# EAGLE design MicroMod-Artemis-ProcessorBoard (EAGLE 9.6.2)
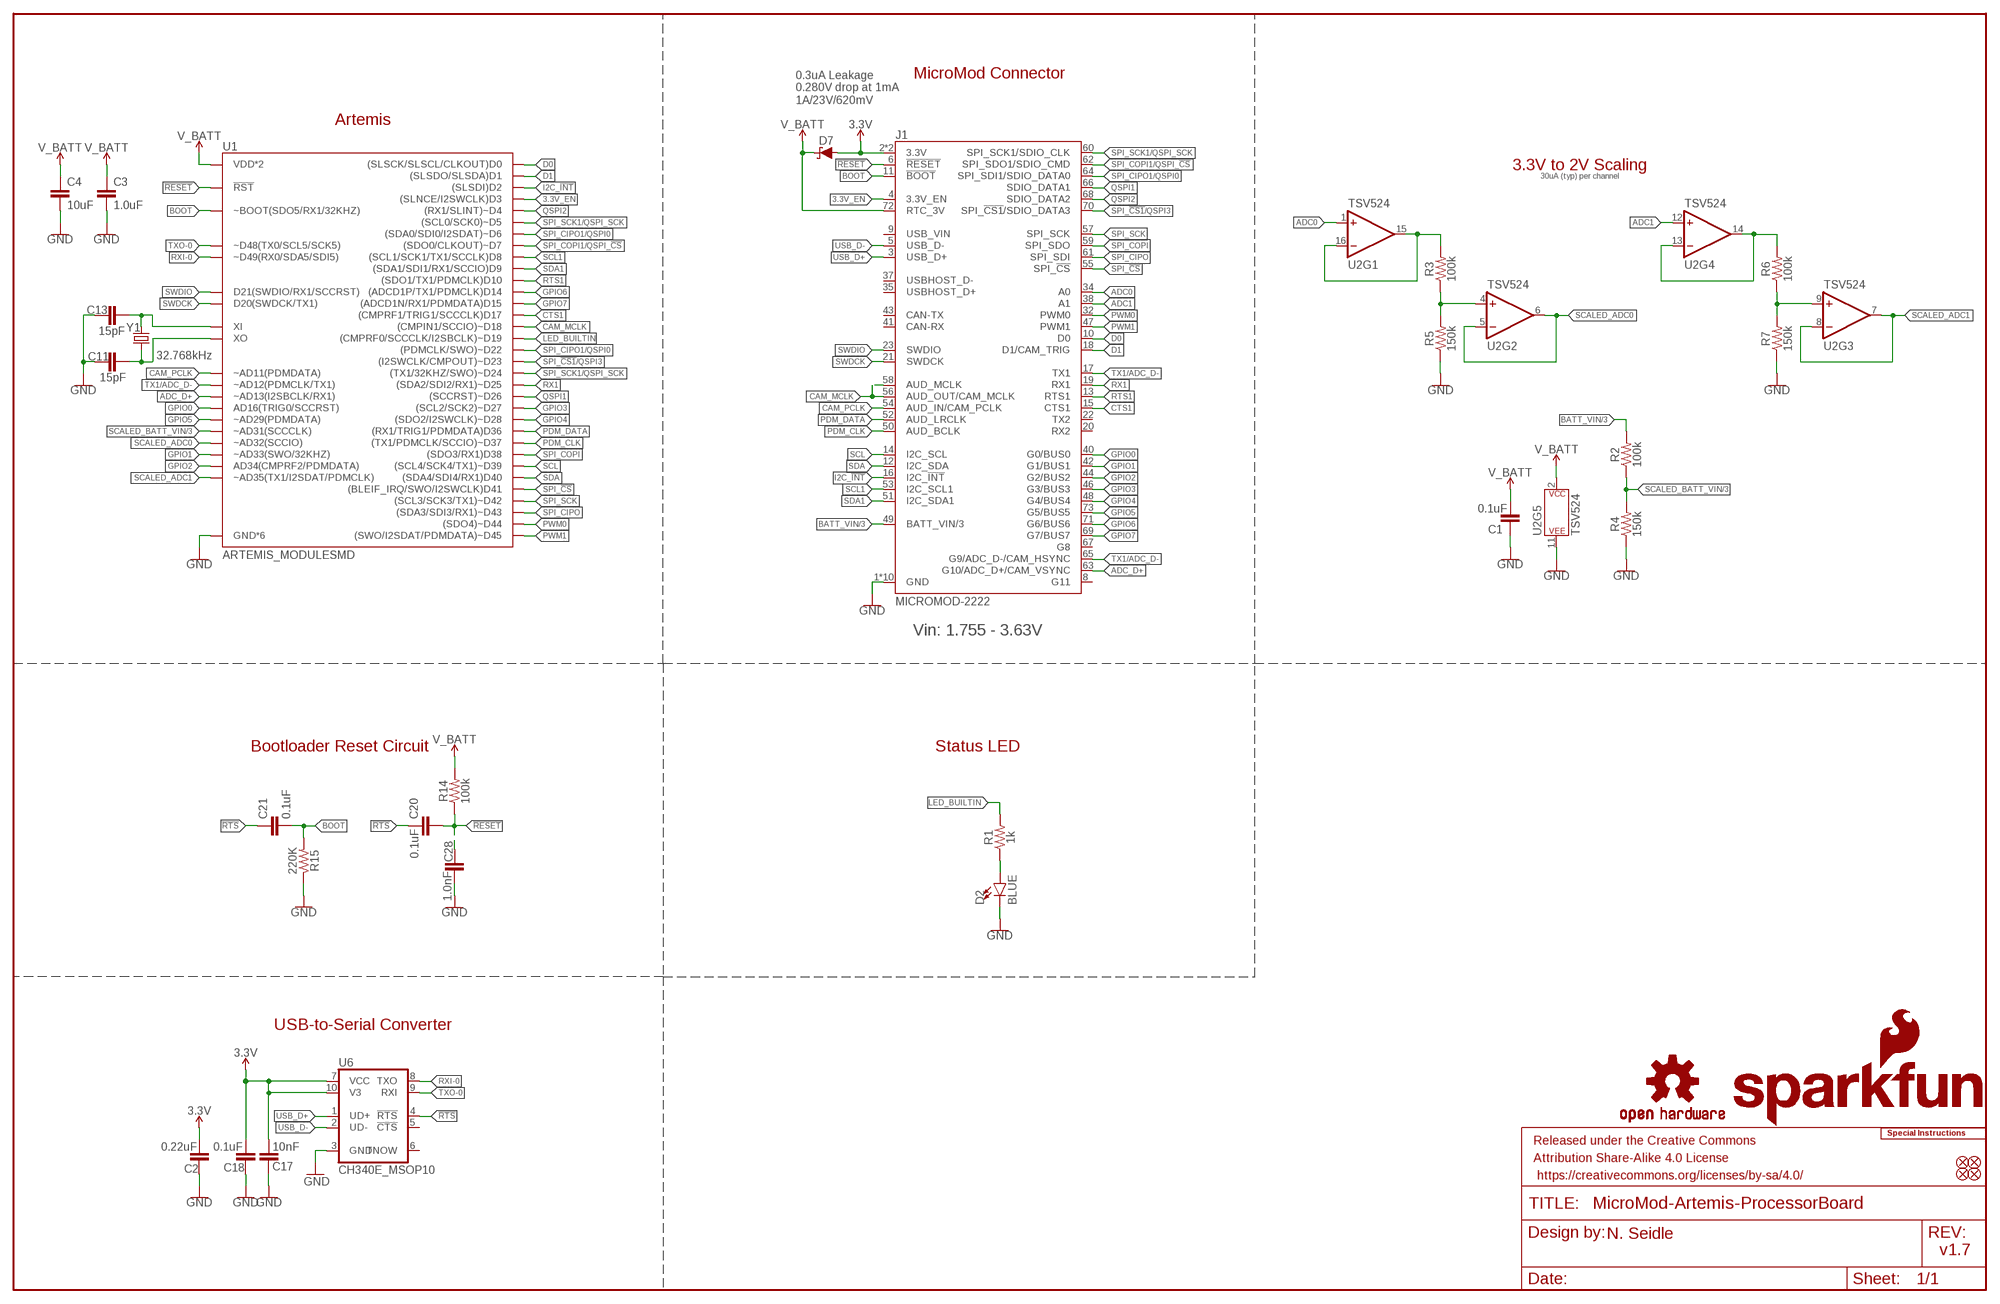
[diagram p0: schematic, sheet 1]

## Parts
C1  0.1uF  0.1UF-0402T-16V-10%  [0402-TIGHT]
C2  0.22uF  0.22UF-0402T-10V-10%  [0402-TIGHT]
C3  1.0uF  1.0UF-0402T-16V-10%  [0402-TIGHT]
C4  10uF  10UF-0603-6.3V-20%  [0603]
C11  15pF  15PF-0402T-50V-5%  [0402-TIGHT]
C13  15pF  15PF-0402T-50V-5%  [0402-TIGHT]
C17  10nF  10NF-0402T-25V-10%  [0402-TIGHT]
C18  0.1uF  0.1UF-0402T-16V-10%  [0402-TIGHT]
C20  0.1uF  0.1UF-0402T-16V-10%  [0402-TIGHT]
C21  0.1uF  0.1UF-0402T-16V-10%  [0402-TIGHT]
C28  1.0nF  1.0NF/1000PF-0402_TIGHT-50V-10%  [0402-TIGHT]
D2  BLUE  LED-BLUE0603  [LED-0603]
D7  1A/23V/620mV  DIODE-SCHOTTKY-BAT20J  [SOD-323]
FD1  FIDUCIALUFIDUCIAL  [FIDUCIAL-MICRO]
FD2  FIDUCIALUFIDUCIAL  [FIDUCIAL-MICRO]
FD3  FIDUCIALUFIDUCIAL  [FIDUCIAL-MICRO]
FD4  FIDUCIALUFIDUCIAL  [FIDUCIAL-MICRO]
FRAME1  FRAME-LEDGER  [CREATIVE_COMMONS]
J1  MICROMOD-2222  [M.2-CARD-E-22]
LOGO1  SFE_LOGO_NAME_FLAME.1_INCH  [SFE_LOGO_NAME_FLAME_.1]
LOGO2  SFE_LOGO_FLAME.1_INCH  [SFE_LOGO_FLAME_.1]
LOGO3  OSHW-LOGOMINI  [OSHW-LOGO-MINI]
LOGO4  SPECIAL_INSTRUCTIONS-ORDERING  [ORDERING_INSTRUCTIONS]
R1  1k  1KOHM-0402T-1/16W-1%  [0402-TIGHT]
R2  100k  100KOHM-0402T-1/16W-1%  [0402-TIGHT]
R3  100k  100KOHM-0402T-1/16W-1%  [0402-TIGHT]
R4  150k  150KOHM-0402T-1/16W-1%  [0402-TIGHT]
R5  150k  150KOHM-0402T-1/16W-1%  [0402-TIGHT]
R6  100k  100KOHM-0402T-1/16W-1%  [0402-TIGHT]
R7  150k  150KOHM-0402T-1/16W-1%  [0402-TIGHT]
R14  100k  100KOHM-0402T-1/16W-1%  [0402-TIGHT]
R15  220K  220KOHM-0402T-1/16W-1%  [0402-TIGHT]
U1  ARTEMIS_MODULESMD  [ARTEMIS_FP]
U2  TSV524  [QFN-16]
U6  CH340E_MSOP10  [MSOP10]
Y1  32.768kHz  CRYSTAL-32.768KHZSMD-3.2X1.5  [CRYSTAL-SMD-3.2X1.5MM]

## Nets
3.3V: C2.1 C17.1 C18.1 D7.A J1.2(3.3V) J1.74(3.3V) U6.7(VCC) U6.10(V3)
3.3V_EN: J1.4(3.3V_EN) U1.D3((SLNCE/I2SWCLK)D3)
!RESET!: C20.2 C28.1 J1.6(!RESET!) R14.1 U1.~RST(!RST)
!RTS: C20.1 C21.1 U6.4(!RTS)
ADC0: J1.34(A0) U2.1(+IN)
ADC0_BUFF1: R3.2 U2.15(OUT) U2.16(-IN)
ADC0_BUFF2: R3.1 R5.2 U2.4(+IN)
ADC1: J1.38(A1) U2.12(+IN)
ADC1_BUFF2: R6.1 R7.2 U2.9(+IN)
ADC_BUFF1: R6.2 U2.13(-IN) U2.14(OUT)
ADC_D+: J1.63(G10/ADC_D+/CAM_VSYNC) U1.~AD13(~AD13(I2SBCLK/RX1))
BATT_VIN/3: J1.49(BATT_VIN/3) R2.2
BOOT: C21.2 J1.11(!BOOT!) R15.2 U1.BOOT(~BOOT(SDO5/RX1/32KHZ))
CAM_MCLK: J1.56(AUD_OUT/CAM_MCLK) J1.58(AUD_MCLK) U1.~D18((CMPIN1/SCCIO)~D18)
CAM_PCLK: J1.54(AUD_IN/CAM_PCLK) U1.~AD11(~AD11(PDMDATA))
CTS1: J1.15(CTS1) U1.D17((CMPRF1/TRIG1/SCCCLK)D17)
D0: J1.10(D0) U1.D0((SLSCK/SLSCL/CLKOUT)D0)
D1: J1.18(D1/CAM_TRIG) U1.D1((SLSDO/SLSDA)D1)
GND: C1.2 C2.2 C3.2 C4.2 C11.1 C13.1 C17.2 C18.2 C28.2 D2.C J1.1(GND) J1.7(GND) J1.33(GND) J1.36(GND) J1.39(GND) J1.45(GND) J1.75(GND) J1.GND1(GND) J1.GND2(GND) J1.GND3(GND) R4.1 R5.1 R7.1 R15.1 U1.GND@1(GND*6) U1.GND@22(GND*6) U1.GND@38(GND*6) U1.GND@39(GND*6) U1.GND@47(GND*6) U1.GND@59(GND*6) U2.11(V-) U6.3(GND)
GPIO0: J1.40(G0/BUS0) U1.AD16(AD16(TRIG0/SCCRST))
GPIO1: J1.42(G1/BUS1) U1.~AD33/SWO(~AD33(SWO/32KHZ))
GPIO2: J1.44(G2/BUS2) U1.AD34(AD34(CMPRF2/PDMDATA))
GPIO3: J1.46(G3/BUS3) U1.~D27((SCL2/SCK2)~D27)
GPIO4: J1.48(G4/BUS4) U1.~D28((SDO2/I2SWCLK)~D28)
GPIO5: J1.73(G5/BUS5) U1.~AD29(~AD29(PDMDATA))
GPIO6: J1.71(G6/BUS6) U1.D14((ADCD1P/TX1/PDMCLK)D14)
GPIO7: J1.69(G7/BUS7) U1.D15((ADCD1N/RX1/PDMDATA)D15)
I2C_!INT!: J1.16(I2C_!INT!) U1.D2((SLSDI)D2)
LED_BUILTIN: R1.2 U1.~D19((CMPRF0/SCCCLK/I2SBCLK)~D19)
N$2: D2.A R1.1
N$5: C13.2 U1.XI Y1.P$1
N$7: C11.2 U1.XO Y1.P$2
PDM_CLK: J1.50(AUD_BCLK) U1.~D37((TX1/PDMCLK/SCCIO)~D37)
PDM_DATA: J1.52(AUD_LRCLK) U1.D36((RX1/TRIG1/PDMDATA)D36)
PWM0: J1.32(PWM0) U1.~D44((SDO4)~D44)
PWM1: J1.47(PWM1) U1.~D45((SWO/I2SDAT/PDMDATA)~D45)
QSPI1: J1.66(SDIO_DATA1) U1.~D26((SCCRST)~D26)
QSPI2: J1.68(SDIO_DATA2) U1.~D4((RX1/SLINT)~D4)
RTS1: J1.13(RTS1) U1.D10((SDO1/TX1/PDMCLK)D10)
RX1: J1.19(RX1) U1.~D25((SDA2/SDI2/RX1)~D25)
RXI-0: U1.RXI-0(~D49(RX0/SDA5/SDI5)) U6.8(TXO)
SCALED_ADC0: U1.~AD32(~AD32(SCCIO)) U2.5(-IN) U2.6(OUT)
SCALED_ADC1: U1.~AD35(~AD35(TX1/I2SDAT/PDMCLK)) U2.7(OUT) U2.8(-IN)
SCALED_BATT_VIN/3: R2.1 R4.2 U1.~AD31(~AD31(SCCCLK))
SCL: J1.14(I2C_SCL) U1.~D39((SCL4/SCK4/TX1)~D39)
SCL1: J1.53(I2C_SCL1) U1.D8((SCL1/SCK1/TX1/SCCLK)D8)
SDA: J1.12(I2C_SDA) U1.D40((SDA4/SDI4/RX1)D40)
SDA1: J1.51(I2C_SDA1) U1.D9((SDA1/SDI1/RX1/SCCIO)D9)
SPI_!CS1!/QSPI3: J1.70(SPI_!CS1!/SDIO_DATA3) U1.~D23((I2SWCLK/CMPOUT)~D23)
SPI_!CS!: J1.55(SPI_!CS!) U1.D41((BLEIF_IRQ/SWO/I2SWCLK)D41)
SPI_CIPO: J1.61(SPI_SDI) U1.~D43((SDA3/SDI3/RX1)~D43)
SPI_CIPO1/QSPI0: J1.64(SPI_SDI1/SDIO_DATA0) U1.~D6((SDA0/SDI0/I2SDAT)~D6) U1.~D22((PDMCLK/SWO)~D22)
SPI_COPI: J1.59(SPI_SDO) U1.D38((SDO3/RX1)D38)
SPI_COPI1/QSPI_!CS!: J1.62(SPI_SDO1/SDIO_CMD) U1.D7((SDO0/CLKOUT)~D7)
SPI_SCK: J1.57(SPI_SCK) U1.~D42((SCL3/SCK3/TX1)~D42)
SPI_SCK1/QSPI_SCK: J1.60(SPI_SCK1/SDIO_CLK) U1.~D5((SCL0/SCK0)~D5) U1.~D24((TX1/32KHZ/SWO)~D24)
SWDCK: J1.21(SWDCK) U1.SWDCK(D20(SWDCK/TX1))
SWDIO: J1.23(SWDIO) U1.SWDIO(D21(SWDIO/RX1/SCCRST))
TX1/ADC_D-: J1.17(TX1) J1.65(G9/ADC_D-/CAM_HSYNC) U1.~AD12(~AD12(PDMCLK/TX1))
TXO-0: U1.TXO-0(~D48(TX0/SCL5/SCK5)) U6.9(RXI)
USB_D+: J1.3(USB_D+) U6.1(UD+)
USB_D-: J1.5(USB_D-) U6.2(UD-)
V_BATT: C1.1 C3.1 C4.1 D7.C J1.72(RTC_3V) R14.2 U1.VDD@36(VDD*2) U1.VDD@37(VDD*2) U2.2(V+)
Unconnected: J1.8(G11) J1.9(USB_VIN) J1.20(RX2) J1.22(TX2) J1.35(USBHOST_D+) J1.37(USBHOST_D-) J1.41(CAN-RX) J1.43(CAN-TX) J1.67(G8) U6.5(!CTS) U6.6(TNOW)

## Notes on the sheet
- MicroMod Connector
- 0.3uA Leakage
  0.280V drop at 1mA
- Artemis
- 3.3V to 2V Scaling
- 30uA (typ) per channel
- Vin: 1.755 - 3.63V
- Bootloader Reset Circuit | Status LED
- USB-to-Serial Converter
- N. Seidle
- v1.7

## Library data of the parts
C1 C18 C20 C21 = SparkFun-Capacitors:0.1UF: 0.1µF ceramic capacitors A capacitor is a passive two-terminal electrical component used to store electrical energy temporarily in an electric field.; PROD_ID: CAP-12416
C2 = SparkFun-Capacitors:0.22UF: 0.22µF ceramic capacitors A capacitor is a passive two-terminal electrical component used to store electrical energy temporarily in an electric field.; PROD_ID: CAP-14846
C3 = SparkFun-Capacitors:1.0UF: 1µF ceramic capacitors A capacitor is a passive two-terminal electrical component used to store electrical energy temporarily in an electric field.; PROD_ID: CAP-12417
C4 = SparkFun-Capacitors:10UF: 10.0µF ceramic capacitors A capacitor is a passive two-terminal electrical component used to store electrical energy temporarily in an electric field.; PROD_ID: CAP-11015
C11 C13 = SparkFun-Capacitors:15PF: 15pF ceramic capacitors A capacitor is a passive two-terminal electrical component used to store electrical energy temporarily in an electric field.; PROD_ID: CAP-13063
C17 = SparkFun-Capacitors:10NF: 0.01uF/10nF/10,000pF ceramic capacitors A capacitor is a passive two-terminal electrical component used to store electrical energy temporarily in an electric field. CAP-09321; PROD_ID: CAP-14847
C28 = SparkFun-Capacitors:1.0NF/1000PF: 1nF/1,000pF ceramic capacitors A capacitor is a passive two-terminal electrical component used to store electrical energy temporarily in an electric field.; PROD_ID: CAP-14280
D2 = SparkFun-LED:LED-BLUE: Blue SMD LED Used in manufacturing of various products at SparkFun Packages: 0603 - SMD 0603 package [Product Link] <http://www.digikey.com/product-detail/en/SMLE12BC7TT86/511-1589-2-ND/1641808> 1206 - SMD1206 package [Product Link] <http://www.digikey.com/product-detail/en/lite-on-inc/LTST-C150TBKT/160-1643-1-ND/573584> SparkFun Products: ESP8266 Thing-Dev Board <https://www.sparkfun.com/products/13711> RedBoard <https://www.sparkfun.com/products/12757>; PROD_ID: DIO-08575
D7 = SparkFun-DiscreteSemi:DIODE-SCHOTTKY: Schottky diode A Schottky diode is a semiconductor diode which has a low forward voltage drop and a very fast switching action.; PROD_ID: DIO-11623
FD1-FD4 = SparkFun-Aesthetics:FIDUCIAL: Fiducial Alignment Points Point-of-reference for pick-and-place machines and other optical instruments.
FRAME1 = SparkFun-Aesthetics:FRAME-LEDGER: Schematic Frame - Ledger Standard 11x14 US Ledger frame
J1 = SparkFun-MicroMod:MICROMOD: MicroMod Connector Description: A card edge connector and mating PCB connector to allow various MicroMod Processor Boards to be coupled with various carrier boards of different capabilities. Based on the M.2 standard.
LOGO1 = SparkFun-Aesthetics:SFE_LOGO_NAME_FLAME: SparkFun Font Logo w/ Flame This is the SparkFun full logo. The logo on the schematic will always be the same size; the package variant is the height of the flame part of the logo. Default layer for the logo on the board is tSilk.
LOGO2 = SparkFun-Aesthetics:SFE_LOGO_FLAME: SparkFun Flame Logo This is the SparkFun flame logo. The logo on the schematic will always be the same size; the package variant is the height of the flame. Default layer for the logo on the board is tSilk.
LOGO3 = SparkFun-Aesthetics:OSHW-LOGO: Open-Source Hardware (OSHW) Logo This logo indicates the piece of hardware it is found on incorporates a OSHW license and/or adheres to the definition of open source hardware found here: http://freedomdefined.org/OSHW
LOGO4 = SparkFun-Aesthetics:SPECIAL_INSTRUCTIONS: Special Ordering/Production Instructions Alert Symbol for special PCB ordering instructions or unique production process warnings. Ordering Instructions Production Instructions Types of information that should be added to box: Copper weight Soldermask color Silk color PCB thickness Number of layers PCB Standard: 1.6mm FR4 1 oz copper immersion silver plating red soldermask white silkscreen Types of information that should be added to box: Special wash requirements Depaneling instructions Humidification Glue curing Default text settings: 0.07 inch 9% ratio 50% line distance
R1 = SparkFun-Resistors:1KOHM: 1kΩ resistor A resistor is a passive two-terminal electrical component that implements electrical resistance as a circuit element. Resistors act to reduce current flow, and, at the same time, act to lower voltage levels within circuits. - Wikipedia; PROD_ID: RES-14342
R2 R3 R6 R14 = SparkFun-Resistors:100KOHM: 100kΩ resistor A resistor is a passive two-terminal electrical component that implements electrical resistance as a circuit element. Resistors act to reduce current flow, and, at the same time, act to lower voltage levels within circuits. - Wikipedia; PROD_ID: RES-13495
R4 R5 R7 = SparkFun-Resistors:150KOHM: 150kΩ resistor A resistor is a passive two-terminal electrical component that implements electrical resistance as a circuit element. Resistors act to reduce current flow, and, at the same time, act to lower voltage levels within circuits. - Wikipedia; PROD_ID: RES-15093
R15 = SparkFun-Resistors:220KOHM: 220kΩ resistor A resistor is a passive two-terminal electrical component that implements electrical resistance as a circuit element. Resistors act to reduce current flow, and, at the same time, act to lower voltage levels within circuits. - Wikipedia; PROD_ID: RES-15094
U1 = SparkFun-IC-Microcontroller:ARTEMIS_MODULE: Description: The Artemis Module from SparkFun is a Cortex-M4F with BLE 5.0 running up to 96MHz and with as low power as 6uA per MHz (less than 5mW). This is the world's first module to bridge the market between hobbyists and consumer products. We've packaged all the power of a modern microcontroller into a module that is both extremely easy to use but is mass-market ready. The flexibility of the Artemis module starts with our [Arduino core](https://github.com/sparkfun/Arduino_Apollo3). You can program and use the Artemis module just like you would an Uno or any other Arduino. Time to first blink is just 5 minutes away! We built the core from the ground up, making it fast and as light weight as possible.; PROD_ID: SUB-14402
U2 = OpAmp:TSV524: IC TSV524 Quad Op Amp; PROD_ID: IC-15092
U6 = SparkFun-IC-Comms:CH340E; PROD_ID: IC-14135
Y1 = SparkFun-Clocks:CRYSTAL-32.768KHZ: 32.768kHz Crystal Frequency: 32.768kHz Frequency Stability: ±20ppm Load Capacitance: 12.5pF (PTH-2X6 & SMD-3.2X1.5), 6pF (SMD-2X6) SparkFun Products: SparkFun BigTime Watch Kit <https://www.sparkfun.com/products/11734> SparkFun nRF52832 Breakout <https://www.sparkfun.com/products/13990> SparkFun Real Time Clock Module <https://www.sparkfun.com/products/12708>; PROD_ID: XTAL-13062

## Net classes
0 default: width 0 mm, drill 0 mm

## Board
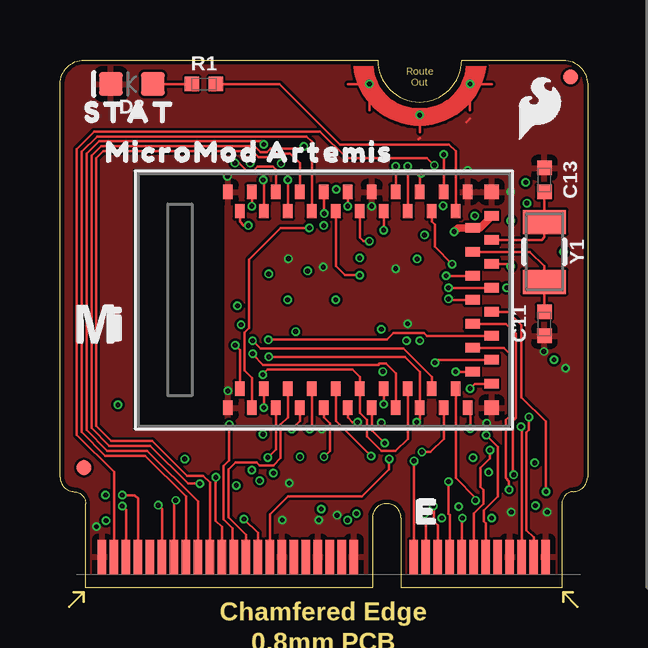
[diagram p1: board, top side]
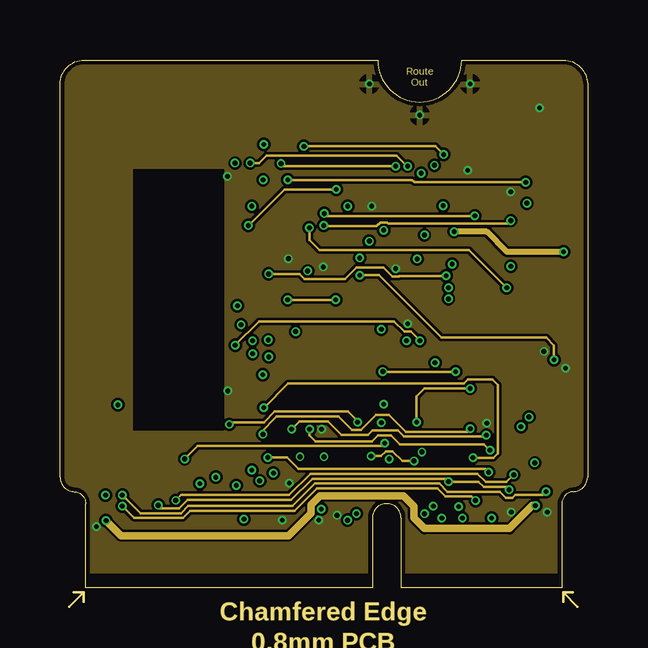
[diagram p2: board, inner layer Horz]
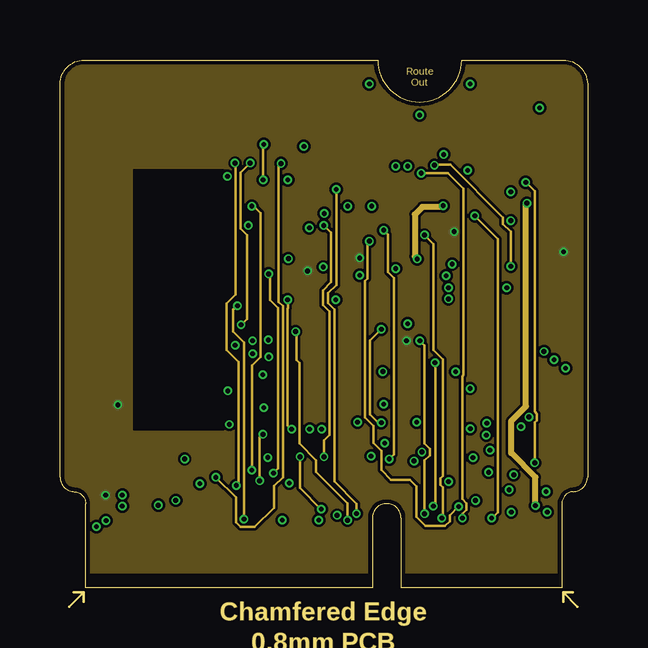
[diagram p3: board, inner layer Vert]
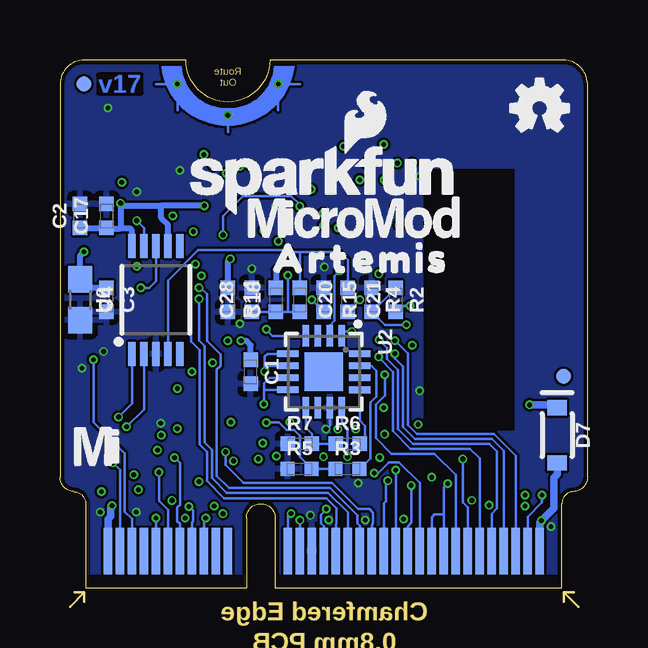
[diagram p4: board, bottom side, seen from below]

Size 22 x 22 mm. Coordinates in mm from the lower left corner, seen from the top.
Outline: 0,4.6 0,21 arc-87 1,22 13.25,22 arc180 16.75,22 21,22 arc-87 22,21 22,4.6
Outline: 0,4.6 arc87 0.6,4
Outline: 21.4,4 arc87 22,4.6
Outline: 21.4,4 arc85 20.93,3.5 20.93,0 14.22,0 14.22,2.9 arc180 13.03,2.9 13.03,0 1.07,0 1.07,3.5 arc84 0.6,4
Outline: 21.4,4 arc87 22,4.6
Outline: 0,4.6 arc87 0.6,4
Copper layers (1+2*15+16): Top 0.035mm / dielectric 1.5mm / Horz 0.035mm / dielectric 0.15mm / Vert 0.035mm / dielectric 0.2mm / Bottom 0.035mm
Design rules "SparkFun-4-layer-MicroMod": minimum track width 4mil, minimum drill 0.2mm, track to track 4mil, track to pad 4mil, pad to pad 4mil, via to via 4mil, smd to smd 4mil, copper to edge 6mil, drill to drill 6mil, minimum pad ring 3mil, minimum via ring 3mil, stop-mask expansion 4mil, vias tented up to drill 25mil, thermal gap 10mil
tKeepout: area 3.1,6.6 to 6.6,17.3

### Footprints (pad centres in the part's own frame; a part is rotated, then mirrored left to right if it is on the bottom)
0402-TIGHT = smd 0.6 x 0.6: 1 -0.5,0; 2 0.5,0
0603 = smd 1.1 x 1: 1 -0.85,0; 2 0.85,0
LED-0603 = smd 1 x 1: A -0.877,0; C 0.877,0
SOD-323 = smd 0.63 x 0.83: A 1.15,0; C -1.15,0
FIDUCIAL-MICRO = smd 0.635 x 0.635: 1 0,0
M.2-CARD-E-22 = smd 0.35 x 1.45: 1 9.25,1.275; 3 8.75,1.275; 5 8.25,1.275; 7 7.75,1.275; 9 7.25,1.275; 11 6.75,1.275; 13 6.25,1.275; 15 5.75,1.275; 17 5.25,1.275; 19 4.75,1.275; 21 4.25,1.275; 23 3.75,1.275; 33 1.25,1.275; 35 0.75,1.275; 37 0.25,1.275; 39 -0.25,1.275; 41 -0.75,1.275; 43 -1.25,1.275; 45 -1.75,1.275; 47 -2.25,1.275; 49 -2.75,1.275; 51 -3.25,1.275; 53 -3.75,1.275; 55 -4.25,1.275; 57 -4.75,1.275; 59 -5.25,1.275; 61 -5.75,1.275; 63 -6.25,1.275; 65 -6.75,1.275; 67 -7.25,1.275; 69 -7.75,1.275; 71 -8.25,1.275; 73 -8.75,1.275; 75 -9.25,1.275 | smd 0.35 x 1.95 bottom: 2 9,1.525; 4 8.5,1.525; 6 8,1.525; 8 7.5,1.525; 10 7,1.525; 12 6.5,1.525; 14 6,1.525; 16 5.5,1.525; 18 5,1.525; 20 4.5,1.525; 22 4,1.525; 32 1.5,1.525; 34 1,1.525; 36 0.5,1.525; 38 0,1.525; 40 -0.5,1.525; 42 -1,1.525; 44 -1.5,1.525; 46 -2,1.525; 48 -2.5,1.525; 50 -3,1.525; 52 -3.5,1.525; 54 -4,1.525; 56 -4.5,1.525; 58 -5,1.525; 60 -5.5,1.525; 62 -6,1.525; 64 -6.5,1.525; 66 -7,1.525; 68 -7.5,1.525; 70 -8,1.525; 72 -8.5,1.525; 74 -9,1.525 | drill 0.2: GND1 1.9,21; GND2 4,19.7; GND3 6.1,21
ARTEMIS_FP = smd 0.4 x 0.6: AD16 -4,-3.7; BOOT 1.5,4.5; D0 0.5,-4.5; D1 -0.5,-4.5; D2 -1,-3.7; D3 2,-3.7; D7 -1.5,4.5; D8 -0.5,4.5; D9 2,3.7; D10 1,3.7; D14 -5,3.7; D17 -3.5,-4.5; D36 2.5,-4.5; D38 3,-3.7; D40 2.5,4.5; D41 -2.5,-4.5; GND@1 4.5,4.5; GND@39 -5.5,-4.5; GND@47 -1.5,-4.5; GND@59 4.5,-4.5; RXI-0 3.5,4.5; SWDCK 4,3.7; SWDIO 0,3.7; TXO-0 0.5,4.5; ~AD31 -3,-3.7; ~AD35 -2,3.7; ~D4 -2.5,4.5; ~D5 -1,3.7; ~D18 -4.5,-4.5; ~D19 -5,-3.7; ~D22 -3.5,4.5; ~D23 -4,3.7; ~D24 -3,3.7; ~D27 -4.5,4.5; ~D28 -5.5,4.5; ~D37 3.5,-4.5; ~D39 3,3.7; ~D42 1.5,-4.5; ~D43 1,-3.7; ~D44 4,-3.7; ~D45 -2,-3.7; ~RST 0,-3.7 | smd 0.6 x 0.4: AD34 -6.5,-0.5; D15 -6.5,0.5; VDD@36 -5.7,-3; VDD@37 -6.5,-3.5; XI -6.5,-2.5; XO -5.7,-2; ~AD11 -5.7,-1; ~AD12 -5.7,2; ~AD13 -5.7,1; ~AD29 -6.5,-1.5; ~AD32 -5.7,3; ~AD33/SWO -5.7,0; ~D6 -6.5,3.5; ~D25 -6.5,2.5; ~D26 -6.5,1.5 | smd 0.6 x 0.6: GND@22 -6.5,4.5; GND@38 -6.5,-4.5
QFN-16 = smd 0.9 x 0.29: 1 -1.5,0.75; 2 -1.5,0.25; 3 -1.5,-0.25; 4 -1.5,-0.75; 9 1.5,-0.75; 10 1.5,-0.25; 11 1.5,0.25; 12 1.5,0.75 | smd 0.29 x 0.9: 5 -0.75,-1.5; 6 -0.25,-1.5; 7 0.25,-1.5; 8 0.75,-1.5; 13 0.765,1.5; 14 0.25,1.5; 15 -0.25,1.5; 16 -0.75,1.5 | smd 1.6 x 1.6: 17 0,0
MSOP10 = smd 1 x 0.3: 1 -2.25,1; 2 -2.25,0.5; 3 -2.25,0; 4 -2.25,-0.5; 5 -2.25,-1; 6 2.25,-1; 7 2.25,-0.5; 8 2.25,0; 9 2.25,0.5; 10 2.25,1
CRYSTAL-SMD-3.2X1.5MM = smd 1 x 1.8: P$1 -1.25,0; P$2 1.25,0

### Placement (x,y rotation side)
C1  14.05,9 270 bottom
C2  21.16,15.5 90 bottom
C3  20.06,12 270 bottom
C4  21.16,12 270 bottom
C11  20.2,11 90 top
C13  20.2,17 270 top
C17  20.06,15.5 90 bottom
C18  15,12 270 bottom
C20  12,12 270 bottom
C21  10,12 270 bottom
C28  14,12 90 bottom
D2  3,21 180 top
D7  1.27,6.35 270 bottom
FD1  1,5 0 top
FD2  21.3,21.3 0 top
FD3  21,21 0 bottom
FD4  1,8.81 0 bottom
FRAME1  -8.89,-8.89 0 top  (outside the outline)
J1  11,0 0 top
LOGO1  11,17 0 bottom
LOGO2  20,20 0 top
LOGO3  2,20 0 bottom
LOGO4  24.54,50.8 0 top  (outside the outline)
R1  6,21 0 top
R2  8,12 270 bottom
R3  10.01,4.95 0 bottom
R4  9,12 270 bottom
R5  12.01,4.95 0 bottom
R6  10,6 0 bottom
R7  12,6 0 bottom
R14  13,12 90 bottom
R15  11,12 270 bottom
U1  11.5,12 180 top
U2  11,9 270 bottom
U6  18,12 90 bottom
U$1  [MICROMOD_MI_LOGO_.35]  1.6,11 0 top
U$5  [MICROMOD_LOGO_.35]  9.8,15.4 0 bottom
U$7  [MICROMOD_MI_LOGO_.35]  20.5,5.9 0 bottom
U$8  [MICROMOD_ARTEMIS0]  1.27,18.16 0 top
U$9  [ARTEMIS0]  13.97,13.72 0 bottom
U$11  [STAT0]  0.38,19.81 0 top
Y1  20.2,14 270 top

### Tracks (layer width: path | path; a pad name or v marks a point on that pad's centre or on a via)
3.3V  (via drill 0.2)
  Horz 0.305: v19.83,3.42 19.7,3.42 18.74,2.46 15.21,2.46 14.77,2.9 14.77,3.39 14.33,3.83 10.85,3.83 10.46,3.44 10.46,3.1 9.53,2.16 2.55,2.16 v1.92,2.79
  Vert 0.254: v19.83,3.42 19.83,4.6 18.82,5.61 18.82,6.95 19.43,7.56 19.43,15.99 v19.47,16.03 | v14.9,13.7 14.79,13.8 14.79,15.56 15.11,15.88 15.93,15.88 v15.98,15.92
  Bottom 0.254: C18.1 15,13.6 v14.9,13.7 | 19.47,14.97 v19.47,16.03 19.37,15.92 17.78,15.92 | C2.1 C17.1 20.03,14.97 19.47,14.97 | 19.47,14.97 19.08,14.97 19,14.9 U6.10 | U6.7 17.5,15.13 17.78,15.41 17.78,15.92 | v15.98,15.92 17.78,15.92
  Bottom 0.305: J1.2 20,2.86 19.89,2.97 19.89,3.36 v19.83,3.42 | J1.74 2,2.71 v1.92,2.79 1.41,3.3 1.41,4.57 1.27,4.71 D7.A
3.3V_EN  (via drill 0.2)
  Top 0.102: v9.5,17 U1.D3
  Horz 0.102: v19.42,16.9 14.78,16.9 14.68,17 v9.5,17
  Vert 0.102: v19.81,5.2 v19.8,5.2 19.8,6.89 19.89,6.98 19.89,7.25 19.8,7.33 19.8,16.52 v19.42,16.9
  Bottom 0.102: J1.4 19.5,4.9 v19.8,5.2
!RESET!  (via drill 0.2)
  Top 0.102: U1.~RST 11.5,13.4 11.88,13.02 v12.5,13.02
  Horz 0.102: v20.6,9.5 20.6,10.1 20.28,10.42 15.9,10.42 13.3,13.02 v12.5,13.02
  Bottom 0.102: C28.1 R14.1 12.5,11.5 | 12.5,11.5 C20.2 | v20.6,9.5 20.6,6.89 19.3,5.59 19.3,3.16 19,2.86 J1.6 | v12.5,13.02 12.5,11.5
!RTS
  Bottom 0.102: U6.4 17.5,12.81 16.23,14.07 12.36,14.07 12.29,14 12,14 | 12,14 10.34,14 10,13.66 C21.1 | C20.1 12,14
ADC0  (via drill 0.2)
  Vert 0.102: v11.99,2.81 11.99,3.52 10.69,4.83 10.69,5.31 9.99,6.01 9.99,9.37 9.86,9.5 9.86,10.67 v9.82,10.67
  Bottom 0.102: J1.34 v12,2.81 v11.99,2.81 | U2.1 10.25,10.63 10.21,10.67 v9.82,10.67
ADC0_BUFF1
  Bottom 0.102: U2.16 U2.15 9.01,9.25 8.8,9.04 8.8,7.98 9.05,7.73 9.05,5.38 9.48,4.95 R3.2
ADC0_BUFF2  (via drill 0.2)
  Vert 0.102: v13.4,10.77 12.92,10.29 12.92,7.21 13.26,6.88 v13.4,6.88
  Bottom 0.102: v13.4,6.88 12.86,6.88 12.54,6.56 12.25,6.56 12,6.31 12,5.44 R5.2 R3.1 | U2.4 13.13,10.5 v13.4,10.77
ADC1  (via drill 0.2)
  Vert 0.102: v10.01,5.45 10.01,4.15 v10.89,3.27
  Bottom 0.102: J1.38 11,2.55 11.12,2.68 11.12,3.04 v10.89,3.27 | U2.12 10.25,6.91 10.01,6.67 v10.01,5.45
ADC1_BUFF2
  Bottom 0.102: R6.1 R7.2 11.5,6.4 11.75,6.65 U2.9
ADC_BUFF1
  Bottom 0.102: U2.14 U2.13 9.5,6.96 9.27,6.74 9.27,6.21 9.48,6 R6.2
ADC_D+  (via drill 0.2)
  Top 0.102: v4.83,3.63 4.75,3.56 J1.63 | U1.~AD13 18.6,11 19,10.6 19,7.08 18.89,6.97 18.89,4.73 v18.92,4.7
  Horz 0.102: v18.92,4.7 18.62,4.4 17.76,4.4 17.41,4.75 10.45,4.75 9.56,3.86 5.05,3.86 v4.83,3.63
BATT_VIN/3  (via drill 0.2)
  Top 0.102: J1.49 8.25,2.27 v7.67,2.85
  Vert 0.102: v7.67,2.85 7.69,2.87 7.69,4.39 7.67,4.41 7.67,10.22 7.22,10.67 7.22,11.59 7.38,11.75 v7.4,11.75
  Bottom 0.102: R2.2 7.75,11.75 v7.4,11.75
BOOT  (via drill 0.2)
  Top 0.102: v17.78,6.35 v17.78,6.34 18.26,5.86 18.26,3.81 17.67,3.22 17.67,2.76 17.75,2.69 J1.11 | v9.66,6.6 10,6.94 U1.BOOT
  Horz 0.102: v17.78,6.35 17.73,6.3 14.34,6.3 14.09,6.55 13.02,6.55 12.83,6.36 11.75,6.36 11.18,6.93 9.99,6.93 v9.66,6.6 | v11.5,12 v9.49,12
  Vert 0.102: v9.66,6.6 9.5,6.76 9.5,11.64 9.5,11.65 9.5,11.94 9.49,11.95 v9.49,12
  Bottom 0.102: R15.2 v11.5,12 | C21.2 v9.5,12 v9.49,12
CAM_MCLK  (via drill 0.2)
  Top 0.102: v5.83,4.33 5.33,4.33 3.76,5.91 2.06,5.91 1.31,6.65 1.31,18 1.72,18.4 8.11,18.4 8.36,18.15 8.64,18.15 8.79,18.3 10.07,18.3 v10.17,18.4 | v16,18.06 U1.~D18
  Horz 0.102: v16,18.06 15.66,18.4 v10.17,18.4
  Bottom 0.102: v5.83,4.33 6,4.17 6,3.05 | J1.56 6.5,2.93 6.38,3.05 6,3.05 | J1.58 6,3.05
CAM_PCLK  (via drill 0.2)
  Top 0.102: U1.~AD11 v16.1,13
  Horz 0.102: v8.7,13.08 9.99,13.08 10.19,12.87 11.89,12.87 12.36,13.35 13.49,13.35 13.86,12.97 14.14,12.97 14.16,13 v16.1,13
  Vert 0.102: v8.7,13.08 8.76,13.02 8.76,11.98 9.09,11.65 9.09,4.96 v8.9,4.77
  Bottom 0.102: J1.54 7,4.37 7.86,5.23 8.29,5.23 8.75,4.77 v8.9,4.77
CTS1  (via drill 0.2)
  Top 0.102: U1.D17 15,17.22 v15.06,17.28 | v16.78,2.9 16.75,2.9 J1.15
  Vert 0.102: v15.06,17.28 16.18,17.28 16.83,16.64 16.83,8.86 16.77,8.81 16.77,3.69 16.95,3.51 16.95,3.24 16.78,3.07 v16.78,2.9
D0  (via drill 0.2)
  Top 0.102: U1.D0 11,15.62 v11.02,15.6
  Horz 0.102: v11.02,15.6 11.12,15.5 v17.3,15.5
  Vert 0.102: v18,2.9 18.03,2.9 18.26,3.13 18.26,14.54 v17.3,15.5
  Bottom 0.102: J1.10 v18,2.9
D1  (via drill 0.2)
  Top 0.102: U1.D1 v12,15.9
  Vert 0.102: v15.92,2.89 15.97,2.94 15.97,4.18 15.87,4.28 15.87,4.55 15.97,4.65 15.97,9.52 15.57,9.91 15.57,14.33 v15.2,14.7
  Bottom 0.102: v15.92,2.89 v15.93,2.89 16,2.82 J1.18 | v15.2,14.7 15.2,15.5 14.37,16.33 12.36,16.33 12,15.96 v12,15.9
GND  (via drill 0.2)
  Top 0.102: 15,18.75 14.95,18.7 | 17.1,19.55 16.95,19.4
  Bottom 0.102: U2.11 10.75,6.76 v10.91,6.6
  other vias: 20.32,3.15 21.08,9.14 17.8,6.86 14.5,11 14,13.3 9.53,13.72 6.99,17.14 1.52,2.54 7,8.2 9.27,2.81 10.79,2.81 11.56,3.01 18.82,3.15 20,20 13,15.9 18.8,16.5 17,17.4 9.56,4.35 10.97,13.37 20.18,9.84
  pour Top (isolate 0.102): 0,22 22,22 22,0.6 0,0.6
  pour Bottom (isolate 0.102): 0,22 22,22 22,0.6 0,0.6
  cutout Bottom (isolate 0.102): 3.1,17.4 6.8,17.4 6.8,6.6 3.1,6.6
  cutout Horz (isolate 0.102): 3.1,17.4 6.8,17.4 6.8,6.6 3.1,6.6
  cutout Vert (isolate 0.102): 3.1,17.4 6.8,17.4 6.8,6.6 3.1,6.6
  cutout Top (isolate 0.102): 3.1,17.4 6.8,17.4 6.8,6.6 3.1,6.6
  pour Horz (isolate 0.102): 0,0.64 0,22 22,22 22,0.64
GPIO0  (via drill 0.2)
  Top 0.102: v16.35,13.49 15.63,14.21 15.63,15.14 15.5,15.27 U1.AD16
  Bottom 0.102: v16.35,13.49 16.53,13.31 16.53,10.26 16.17,9.91 16.17,5.96 15.87,5.66 15.87,4.45 15.16,3.73 10.89,3.73 10.47,3.3 10.47,2.68 10.5,2.64 J1.40
GPIO1  (via drill 0.2)
  Top 0.102: U1.~AD33/SWO 16.23,12 v16.2,12.04
  Bottom 0.102: v16.2,12.04 16.2,10.3 15.97,10.07 15.97,6.04 15.66,5.74 15.66,4.57 15.04,3.95 10.83,3.95 10,3.12 J1.42
GPIO2  (via drill 0.2)
  Top 0.102: U1.AD34 v16.2,12.5
  Bottom 0.102: v16.2,12.5 16.14,12.5 15.87,12.24 15.87,10.28 15.31,9.71 15.31,9.24 15.46,9.09 15.46,4.66 14.96,4.16 10.74,4.16 9.6,3.01 9.6,2.68 9.5,2.58 J1.44
GPIO3  (via drill 0.2)
  Top 0.102: U1.~D27 16,6.2 15.45,5.65 v15.09,5.65
  Bottom 0.102: v15.09,5.65 15.09,5.11 14.35,4.36 10.66,4.36 9.57,3.27 9.1,3.27 8.94,3.12 8.94,2.68 9,2.62 J1.46
GPIO4  (via drill 0.2)
  Top 0.102: U1.~D28 17.11,7.39 v17.11,6.62
  Horz 0.102: v17.11,6.62 16.98,6.5 14.43,6.5 13.72,7.21 13.19,7.21 12.54,6.56 12.18,6.56 11.62,7.13 9.03,7.13 8.38,6.47 v8.46,6.39
  Vert 0.102: v8.46,6.39 8.33,6.25 v8.33,4.45
  Bottom 0.102: J1.48 8.5,3.5 8.4,3.6 8.4,4.38 v8.33,4.45
GPIO5  (via drill 0.2)
  Top 0.102: J1.73 2.25,4.82 0.7,6.37 0.7,18.29 1.43,19.02 10.09,19.02 10.09,19.01 10.85,19.01 11.96,17.9 15.3,17.9 15.59,17.61 v15.61,17.61 | U1.~AD29 18.7,13.5 v18.8,13.4
  Vert 0.102: v18.8,13.4 18.8,14.84 18.47,15.16 18.47,15.43 16.27,17.63 15.63,17.63 v15.61,17.61
GPIO6  (via drill 0.2)
  Top 0.102: v2.6,3.4 2.75,3.25 J1.71 | U1.D14 16.5,4.57 17.33,3.74 v17.33,3.63
  Horz 0.102: v2.6,3.4 3.1,2.9 5.13,2.9 5.43,3.2 9.79,3.2 10.72,4.13 15.73,4.13 16.07,3.79 17.16,3.79 v17.33,3.63
GPIO7  (via drill 0.2)
  Top 0.102: v2.6,3.85 3.11,3.85 3.25,3.71 J1.69 | U1.D15 18.7,11.5 19.25,10.95 19.25,7.94 20.27,6.92 v20.27,4
  Horz 0.102: v2.6,3.85 2.73,3.73 2.74,3.73 3.36,3.1 5.05,3.1 5.35,3.4 9.71,3.4 10.64,4.34 15.81,4.34 16.16,4 18.34,4 18.59,3.75 18.86,3.75 18.98,3.87 20.13,3.87 v20.27,4
I2C_!INT!  (via drill 0.2)
  Top 0.102: v12.9,14.44 12.66,14.44 12.5,14.6 U1.D2
  Vert 0.102: v12.9,14.44 12.83,14.37 12.83,12.88 12.72,12.77 12.72,7.09 13.07,6.74 13.07,6.02 13.4,5.7 13.4,4.9 13.8,4.5 14.6,4.5 14.87,4.23 14.87,2.94 15.25,2.56 16.06,2.56 16.25,2.76 16.25,3.01 v16.62,3.38
  Bottom 0.102: v16.62,3.38 16.45,3.21 16.45,2.76 16.5,2.72 J1.16
LED_BUILTIN
  Top 0.102: R1.2 9.15,21 11.68,18.48 16.22,18.48 16.5,18.2 U1.~D19
N$2
  Top 0.102: R1.1 D2.A
N$5
  Top 0.102: C13.2 Y1.P$1 20.2,14.61 20.09,14.5 U1.XI
N$7
  Top 0.102: U1.XO 19.6,14 20.2,13.4 Y1.P$2 C11.2
PDM_CLK  (via drill 0.2)
  Top 0.102: v8,15.9 U1.~D37
  Vert 0.102: v8,15.9 8.07,15.9 8.36,15.61 8.36,9.89 8.36,9.62 8,9.26 v8,4.9
  Bottom 0.102: J1.50 v8,4.9
PDM_DATA  (via drill 0.2)
  Top 0.102: U1.D36 9,17.43 8.89,17.55 8.24,17.55 8.06,17.37 7.79,17.37 7.46,17.7 v7.3,17.7
  Vert 0.102: v7.36,4.26 7.46,4.36 7.46,9.41 6.95,9.91 6.95,11.85 7.33,12.23 7.33,17.67 v7.3,17.69 v7.3,17.7
  Bottom 0.102: J1.52 7.5,2.56 7.34,2.71 7.34,4.24 v7.36,4.26
PWM0  (via drill 0.2)
  Top 0.102: U1.~D44 7.5,15.26 7.66,15.1 v7.86,15.1
  Horz 0.102: v11.52,16.6 9.36,16.6 v7.86,15.1
  Vert 0.102: v12.37,3.08 12.37,3.5 11.44,4.42 11.44,11.59 11.17,11.86 11.17,12.27 11.52,12.62 v11.52,16.6
  Bottom 0.102: J1.32 12.5,2.95 v12.37,3.08
PWM1  (via drill 0.2)
  Top 0.102: v13.73,5.36 13.73,4.93 12.6,3.8 9.5,3.8 8.75,3.05 J1.47 | v13.5,14.9 U1.~D45
  Vert 0.102: v13.73,5.36 13.92,5.55 13.92,12.91 13.67,13.16 13.67,14.73 v13.5,14.9
QSPI1  (via drill 0.2)
  Top 0.102: v8.69,10.32 8.71,10.34 13.64,10.34 13.91,10.62 15.18,10.62 15.3,10.5 U1.~D26
  Bottom 0.102: J1.66 4,3.07 3.77,3.3 3.77,5.68 4.08,5.99 7.29,5.99 7.91,6.61 7.91,9.08 8.36,9.54 8.36,10 v8.69,10.32
QSPI2  (via drill 0.2)
  Top 0.102: v8.03,9.75 8.03,9.73 8.47,9.29 13.28,9.29 13.33,9.33 13.6,9.33 14,8.93 U1.~D4
  Bottom 0.102: J1.68 3.5,5.7 4,6.2 7.21,6.2 7.7,6.69 7.7,9.22 8.03,9.55 v8.03,9.75
RTS1  (via drill 0.2)
  Top 0.102: U1.D10 10.5,6.69 v10.41,6.6 | v17.93,5.73 17.93,5.38 17.53,4.98 17.53,4.19 17.66,4.07 17.66,3.49 17.25,3.09 J1.13
  Horz 0.102: v17.93,5.73 17.68,5.98 14.17,5.98 13.8,6.35 13.26,6.35 13.01,6.1 10.66,6.1 10.41,6.35 v10.41,6.6
RX1  (via drill 0.2)
  Top 0.102: v15.64,9.38 15.76,9.5 U1.~D25 | v15.57,3.4 15.59,3.38 15.59,2.76 15.75,2.6 J1.19
  Vert 0.102: v15.57,3.4 15.65,3.4 v15.65,9.37 v15.64,9.38
RXI-0  (via drill 0.2)
  Top 0.102: v10.4,15 9.2,15 7.88,13.68 7.88,10.82 7.7,10.64 7.7,9.05 8,8.75 U1.RXI-0
  Horz 0.102: v18.63,12.5 17.06,14.07 10.81,14.07 10.4,14.48 v10.4,15
  Bottom 0.102: v18.63,12.5 18.28,12.5 18,12.78 U6.8
SCALED_ADC0  (via drill 0.2)
  Top 0.102: v16.5,9 U1.~AD32
  Horz 0.102: v13.46,9.01 v13.47,9 v16.5,9
  Bottom 0.102: U2.5 13.35,9.75 13.46,9.64 13.46,9.27 | v13.46,9.01 13.46,9.27 | 13.46,9.27 13.44,9.25 U2.6
SCALED_ADC1  (via drill 0.2)
  Top 0.102: v13.5,7.65 U1.~AD35
  Bottom 0.102: U2.8 13.49,8.25 13.5,8.26 | U2.7 13.25,8.75 13.5,8.5 13.5,8.26 | 13.5,8.26 v13.5,7.65
SCALED_BATT_VIN/3  (via drill 0.2)
  Top 0.102: U1.~AD31 v14.5,17.57
  Horz 0.102: v14.5,17.57 14.46,17.57 14.03,18.01 8.62,18.01 8.31,17.7 v7.93,17.7
  Vert 0.102: v7.93,17.7 7.53,17.3 7.53,14.96 7.8,14.7 7.8,11.2 v7.55,10.96
  Bottom 0.102: R2.1 R4.2 8.46,10.96 v7.55,10.96
SCL  (via drill 0.2)
  Top 0.102: v8.5,7.5 U1.~D39
  Horz 0.102: v17.22,5.42 17.24,5.4 18.07,5.4 18.26,5.59 18.26,8.44 18.03,8.67 17.01,8.67 16.84,8.5 9.5,8.5 v8.5,7.5
  Bottom 0.102: v17.22,5.42 17,5.2 17,3.45 17.11,3.34 17.11,2.76 17,2.65 J1.14
SCL1  (via drill 0.2)
  Top 0.102: v12.41,6.89 12.21,6.89 12,7.1 U1.D8 | v7.06,6.8 7.06,5.3 6.83,5.07 6.83,2.84 7.2,2.47 7.2,1.32 J1.53
  Horz 0.102: v12.41,6.89 12.41,6.94 12.01,7.33 8.95,7.33 8.5,6.89 7.11,6.89 7.06,6.84 v7.06,6.8
SDA  (via drill 0.2)
  Top 0.102: U1.D40 9,5.76 v8.67,5.43
  Horz 0.102: v17.87,4.81 17.73,4.95 9.95,4.95 9.47,5.43 v8.67,5.43
  Bottom 0.102: v17.87,4.81 17.87,3.61 17.5,3.24 J1.12
SDA1
  Top 0.102: U1.D9 9.5,7.1 9.2,6.8 9.2,5.4 8.9,5.1 8.33,5.1 8.2,5.23 7.33,5.23 7.03,4.93 7.03,2.93 7.75,2.21 J1.51
SPI_!CS1!/QSPI3  (via drill 0.2)
  Top 0.102: U1.~D23 15.5,8.78 14.31,9.97 8.36,9.97 v8.03,10.29
  Bottom 0.102: v8.03,10.29 7.5,9.76 7.5,6.78 7.12,6.4 3.9,6.4 3,5.5 J1.70
SPI_!CS!  (via drill 0.2)
  Top 0.102: U1.D41 v14,17.57 | J1.55 6.75,2.53 6.5,2.78 v6.5,4.6
  Horz 0.102: v14,17.57 9.29,17.57 9.22,17.65 v9.22,17.68
  Vert 0.102: v9.22,17.68 9.12,17.58 9.12,11.91 9.3,11.73 9.29,11.73 9.29,4.6 8.93,4.24 8.93,3.33 8.12,2.52 7.54,2.52 7.34,2.71 7.34,3.75 v6.5,4.6
SPI_CIPO
  Top 0.102: U1.~D43 10.5,18.6 10.29,18.81 1.55,18.81 0.91,18.17 0.91,6.48 1.89,5.5 3.55,5.5 5.25,3.8 J1.61
SPI_CIPO1/QSPI0  (via drill 0.2)
  Top 0.102: U1.~D6 17.3,8.5 v17.1,8.3 | v14.87,6.9 15,7.03 U1.~D22 15,8.99 14.38,9.62 v8.71,9.62
  Horz 0.102: v17.1,8.3 15.2,8.3 14.87,7.97 v14.87,6.9
  Bottom 0.102: J1.64 4.5,5.39 4.9,5.79 7.38,5.79 8.11,6.53 8.11,9 8.66,9.55 8.66,9.57 v8.71,9.62
SPI_COPI  (via drill 0.2)
  Top 0.102: v8.5,18.48 8.38,18.61 1.63,18.61 1.11,18.08 1.11,6.57 1.98,5.7 3.63,5.7 5.75,3.59 J1.59 | v8.47,17 8.5,16.97 U1.D38
  Vert 0.102: v8.5,18.48 8.47,18.45 v8.47,17
SPI_COPI1/QSPI_!CS!  (via drill 0.2)
  Top 0.102: U1.D7 13,6.56 v13.54,6.02
  Horz 0.102: v13.54,6.02 13.54,5.9 5.74,5.9 v5.2,5.36
  Bottom 0.102: v5.2,5.36 5.2,3.54 5,3.34 J1.62
SPI_SCK
  Top 0.102: U1.~D42 10,17.7 9.6,18.1 8.87,18.1 8.72,17.95 8.28,17.95 8.03,18.2 1.8,18.2 1.52,17.92 1.52,6.74 2.14,6.11 3.85,6.11 5.29,4.66 5.97,4.66 6.25,4.38 J1.57
SPI_SCK1/QSPI_SCK  (via drill 0.2)
  Top 0.102: v8.46,8.88 8.66,9.09 12.2,9.09 12.5,8.79 U1.~D5 12.5,7.28 12.8,6.99 12.8,6.3 13.41,5.69 13.99,5.69 14.5,6.2 U1.~D24
  Bottom 0.102: J1.60 5.5,4.7 6.38,5.58 8.17,5.58 8.83,6.24 8.83,7.64 8.46,8.01 v8.46,8.88
SWDCK  (via drill 0.2)
  Top 0.102: v15.2,3.08 15.25,3.08 J1.21 | v7.31,10.11 7.5,9.91 U1.SWDCK
  Horz 0.102: v15.01,10.29 14.63,10.67 14.36,10.67 13.94,11.1 8.3,11.1 v7.31,10.11
  Vert 0.102: v15.01,10.29 15.2,10.1 15.2,6.01 15.42,5.79 15.42,5.51 15.2,5.29 v15.2,3.08
SWDIO  (via drill 0.2)
  Top 0.102: J1.23 14.75,5.26 v14.77,5.28 | v12.97,5.48 11.5,6.95 U1.SWDIO
  Horz 0.102: v14.77,5.28 14.27,5.28 13.86,5.69 13.59,5.69 13.38,5.48 v12.97,5.48
TX1/ADC_D-  (via drill 0.2)
  Top 0.102: v4.1,3.43 4.25,3.28 J1.65 | v18.73,4.08 18.73,4.43 18.59,4.56 18.59,6.99 18.8,7.2 18.8,9.7 18.5,10 U1.~AD12 | v16.2,4.42 16.2,3.08 16.25,3.03 J1.17
  Horz 0.102: v4.1,3.43 4.1,3.4 4.19,3.31 4.96,3.31 5.32,3.66 9.64,3.66 10.53,4.54 16.08,4.54 v16.2,4.42 17.46,4.42 17.67,4.2 18.6,4.2 v18.73,4.08
TXO-0  (via drill 0.2)
  Top 0.102: U1.TXO-0 11,7.1 11.26,6.84 11.26,5.7 v11.01,5.45
  Horz 0.102: v11,15.1 11.03,15.07 13.21,15.07 13.36,15.23 13.64,15.23 13.69,15.17 18.67,15.17 v18.8,15.3
  Vert 0.102: v11,15.1 v11.01,15.1 11.3,14.8 11.3,12.73 10.97,12.39 10.97,11.78 11.24,11.51 11.24,6.36 11.01,6.13 v11.01,5.45
  Bottom 0.102: v18.8,15.3 18.5,15 U6.9
USB_D+  (via drill 0.2)
  Top 0.102: v19.56,7.11 v19.55,7.11 19.55,6.58 19.45,6.48 19.45,2.39 19.75,2.09 J1.3
  Bottom 0.102: v19.56,7.11 19,7.67 U6.1
USB_D-  (via drill 0.2)
  Top 0.102: v19.22,6.71 19.25,6.68 J1.5
  Bottom 0.102: v19.22,6.71 18.5,7.43 U6.2
V_BATT  (via drill 0.2)
  Top 0.305: U1.VDD@37 17.5,15 U1.VDD@36 16.59,15 v16.43,14.84
  Horz 0.254: v21,14 18.64,14 17.8,14.84 v16.43,14.84
  Bottom 0.102: U2.2 10.75,10.93 10.55,11.14 10.55,12.98 v10.33,13.2 | J1.72 2.5,2.95 1.9,3.55 v1.9,3.85
  Bottom 0.254: v12.5,13.74 13,13.24 R14.2 | C1.1 14.05,10.1 14.24,10.29 v14.45,10.29 | C3.1 20.81,12.5 C4.1 21.16,13.84 v21,14
  Bottom 0.305: D7.C 1.39,7.62 v2.41,7.62
  pour Vert (isolate 0.102): 0,22 22,22 22,0.64 0,0.64

### Text on the board
Bottom: v17
tDocu: 0.8mm PCB / 45 degree chamfered edge / Four layer design | N. Seidle